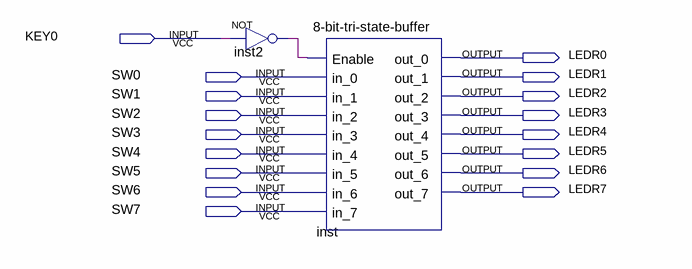
[diagram p0: schematic sheet]
// Quartus schematic Testbench.bdf as structural Verilog: 2 symbols, 17 pins
module Testbench (
  input  KEY0,
  input  SW0,
  input  SW1,
  input  SW2,
  input  SW3,
  input  SW4,
  input  SW5,
  input  SW6,
  input  SW7,
  output LEDR0,
  output LEDR1,
  output LEDR2,
  output LEDR3,
  output LEDR4,
  output LEDR5,
  output LEDR6,
  output LEDR7
);

  wire inst2_out;

  not inst2 (inst2_out, KEY0);
  \8-bit-tri-state-buffer  inst (
    .Enable(inst2_out), .in_0(SW0), .in_1(SW1), .in_2(SW2), .in_3(SW3), .in_4(SW4), .in_5(SW5), .in_6(SW6),
    .in_7(SW7), .out_0(LEDR0), .out_1(LEDR1), .out_2(LEDR2), .out_3(LEDR3), .out_4(LEDR4), .out_5(LEDR5),
    .out_6(LEDR6), .out_7(LEDR7));
endmodule
